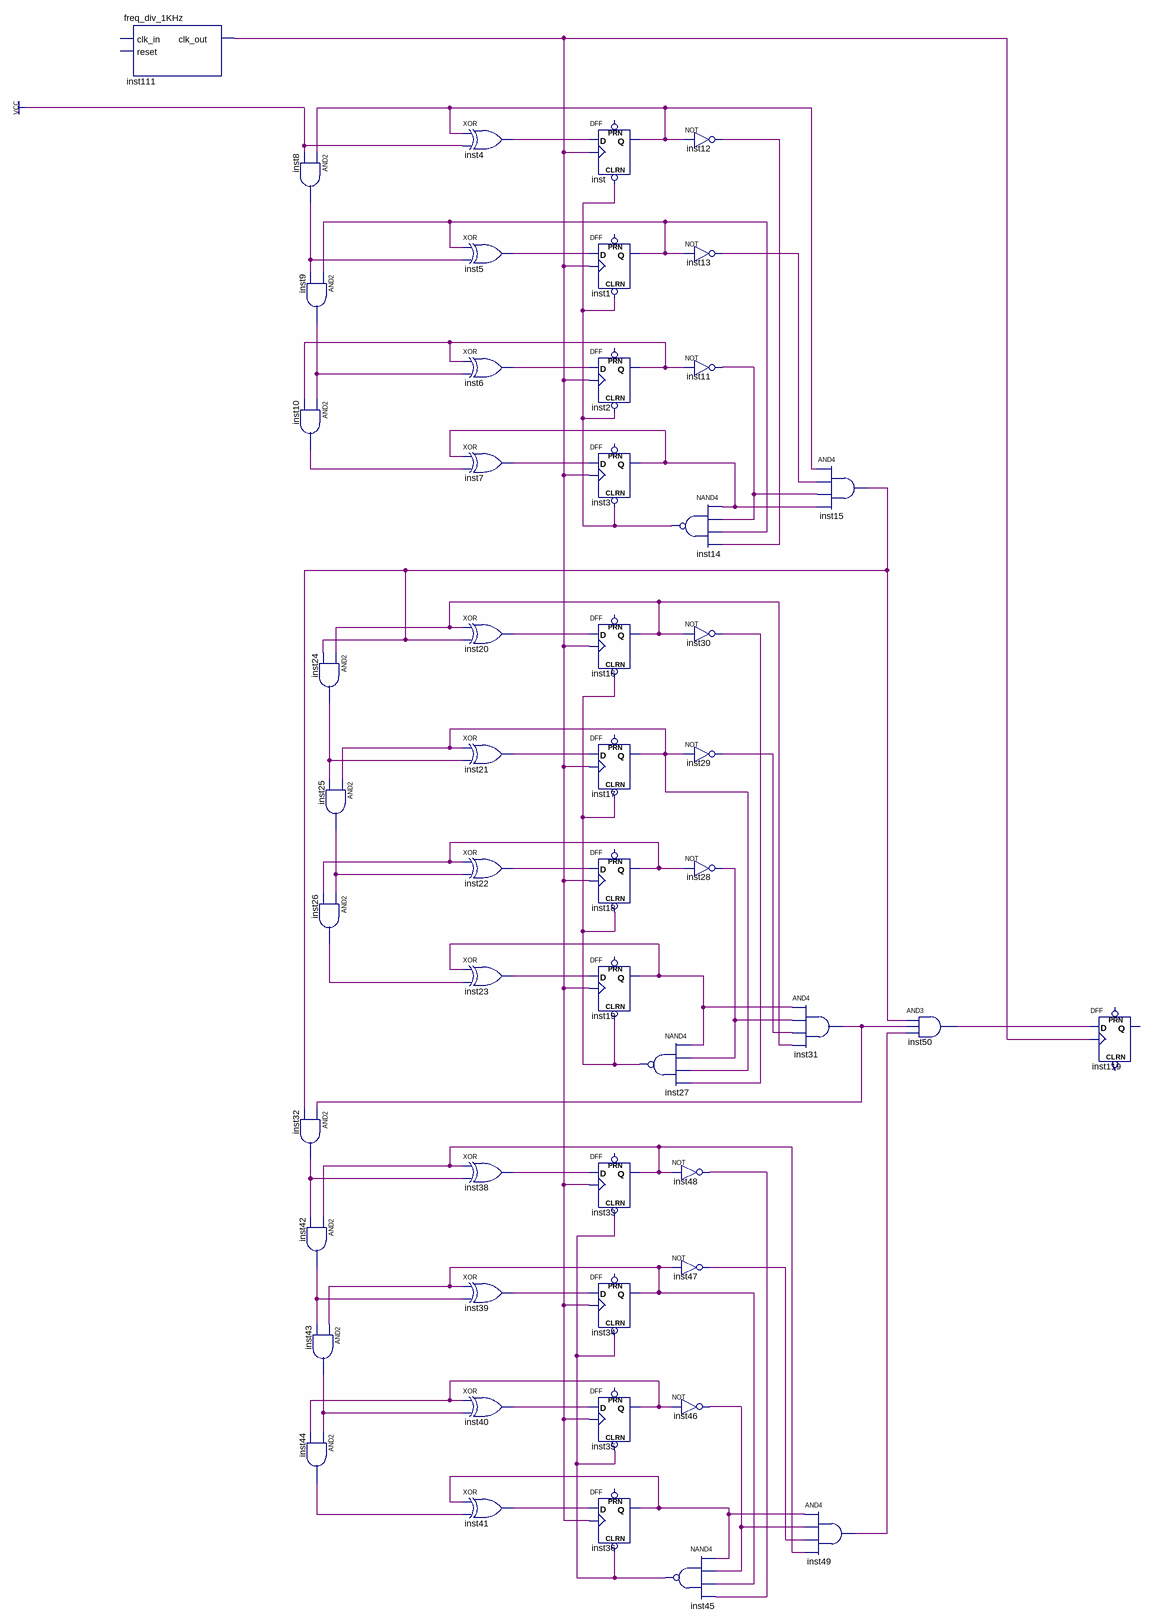
[diagram p0: schematic sheet]
// Quartus schematic Block2.bdf as structural Verilog: 52 symbols, 0 pins
module Block2 (
);

  wire inst1_q, inst2_q, inst3_q, inst4_out, inst5_out, inst6_out, inst7_out, inst8_out, inst9_out,
       inst10_out, inst11_out, inst12_out, inst13_out, inst14_out, inst15_out, inst16_q, inst17_q, inst18_q,
       inst19_q, inst20_out, inst21_out, inst22_out, inst23_out, inst24_out, inst25_out, inst26_out,
       inst27_out, inst28_out, inst29_out, inst30_out, inst31_out, inst32_out, inst33_q, inst34_q, inst35_q,
       inst36_q, inst38_out, inst39_out, inst40_out, inst41_out, inst42_out, inst43_out, inst44_out,
       inst45_out, inst46_out, inst47_out, inst48_out, inst49_out, inst50_out, inst111_clk_out, inst_q;

  freq_div_1KHz inst111 (.clk_out(inst111_clk_out));  // open: clk_in, reset
  and inst8 (inst8_out, inst_q, 1'b1);
  and inst9 (inst9_out, inst1_q, inst8_out);
  and inst10 (inst10_out, inst9_out, inst2_q);
  and inst24 (inst24_out, inst16_q, inst15_out);
  and inst25 (inst25_out, inst17_q, inst24_out);
  and inst26 (inst26_out, inst25_out, inst18_q);
  and inst32 (inst32_out, inst31_out, inst15_out);
  and inst42 (inst42_out, inst33_q, inst32_out);
  and inst43 (inst43_out, inst34_q, inst42_out);
  and inst44 (inst44_out, inst43_out, inst35_q);
  xor inst4 (inst4_out, inst_q, 1'b1);
  xor inst5 (inst5_out, inst1_q, inst8_out);
  xor inst6 (inst6_out, inst2_q, inst9_out);
  xor inst7 (inst7_out, inst3_q, inst10_out);
  xor inst20 (inst20_out, inst16_q, inst15_out);
  xor inst21 (inst21_out, inst17_q, inst24_out);
  xor inst22 (inst22_out, inst18_q, inst25_out);
  xor inst23 (inst23_out, inst19_q, inst26_out);
  xor inst38 (inst38_out, inst33_q, inst32_out);
  xor inst39 (inst39_out, inst34_q, inst42_out);
  xor inst40 (inst40_out, inst35_q, inst43_out);
  xor inst41 (inst41_out, inst36_q, inst44_out);
  DFF inst (.CLRN(inst14_out), .CLK(inst111_clk_out), .D(inst4_out), .Q(inst_q));  // open: PRN
  DFF inst1 (.CLRN(inst14_out), .CLK(inst111_clk_out), .D(inst5_out), .Q(inst1_q));  // open: PRN
  DFF inst2 (.CLRN(inst14_out), .CLK(inst111_clk_out), .D(inst6_out), .Q(inst2_q));  // open: PRN
  DFF inst3 (.CLRN(inst14_out), .CLK(inst111_clk_out), .D(inst7_out), .Q(inst3_q));  // open: PRN
  DFF inst16 (.CLRN(inst27_out), .CLK(inst111_clk_out), .D(inst20_out), .Q(inst16_q));  // open: PRN
  DFF inst17 (.CLRN(inst27_out), .CLK(inst111_clk_out), .D(inst21_out), .Q(inst17_q));  // open: PRN
  DFF inst18 (.CLRN(inst27_out), .CLK(inst111_clk_out), .D(inst22_out), .Q(inst18_q));  // open: PRN
  DFF inst19 (.CLRN(inst27_out), .CLK(inst111_clk_out), .D(inst23_out), .Q(inst19_q));  // open: PRN
  DFF inst33 (.CLRN(inst45_out), .CLK(inst111_clk_out), .D(inst38_out), .Q(inst33_q));  // open: PRN
  DFF inst34 (.CLRN(inst45_out), .CLK(inst111_clk_out), .D(inst39_out), .Q(inst34_q));  // open: PRN
  DFF inst35 (.CLRN(inst45_out), .CLK(inst111_clk_out), .D(inst40_out), .Q(inst35_q));  // open: PRN
  DFF inst36 (.CLRN(inst45_out), .CLK(inst111_clk_out), .D(inst41_out), .Q(inst36_q));  // open: PRN
  nand inst14 (inst14_out, inst3_q, inst11_out, inst1_q, inst12_out);
  nand inst27 (inst27_out, inst19_q, inst28_out, inst17_q, inst30_out);
  not inst48 (inst48_out, inst33_q);
  not inst47 (inst47_out, inst34_q);
  not inst46 (inst46_out, inst35_q);
  nand inst45 (inst45_out, inst36_q, inst46_out, inst34_q, inst48_out);
  not inst12 (inst12_out, inst_q);
  not inst13 (inst13_out, inst1_q);
  not inst11 (inst11_out, inst2_q);
  not inst30 (inst30_out, inst16_q);
  not inst29 (inst29_out, inst17_q);
  not inst28 (inst28_out, inst18_q);
  and inst15 (inst15_out, inst_q, inst13_out, inst11_out, inst3_q);
  and inst31 (inst31_out, inst19_q, inst28_out, inst29_out, inst16_q);
  and inst49 (inst49_out, inst36_q, inst46_out, inst47_out, inst33_q);
  and inst50 (inst50_out, inst15_out, inst31_out, inst49_out);
  DFF inst119 (.CLK(inst111_clk_out), .D(inst50_out));  // open: CLRN, PRN, Q
endmodule
